# Altium project esp32v4.PrjPcb
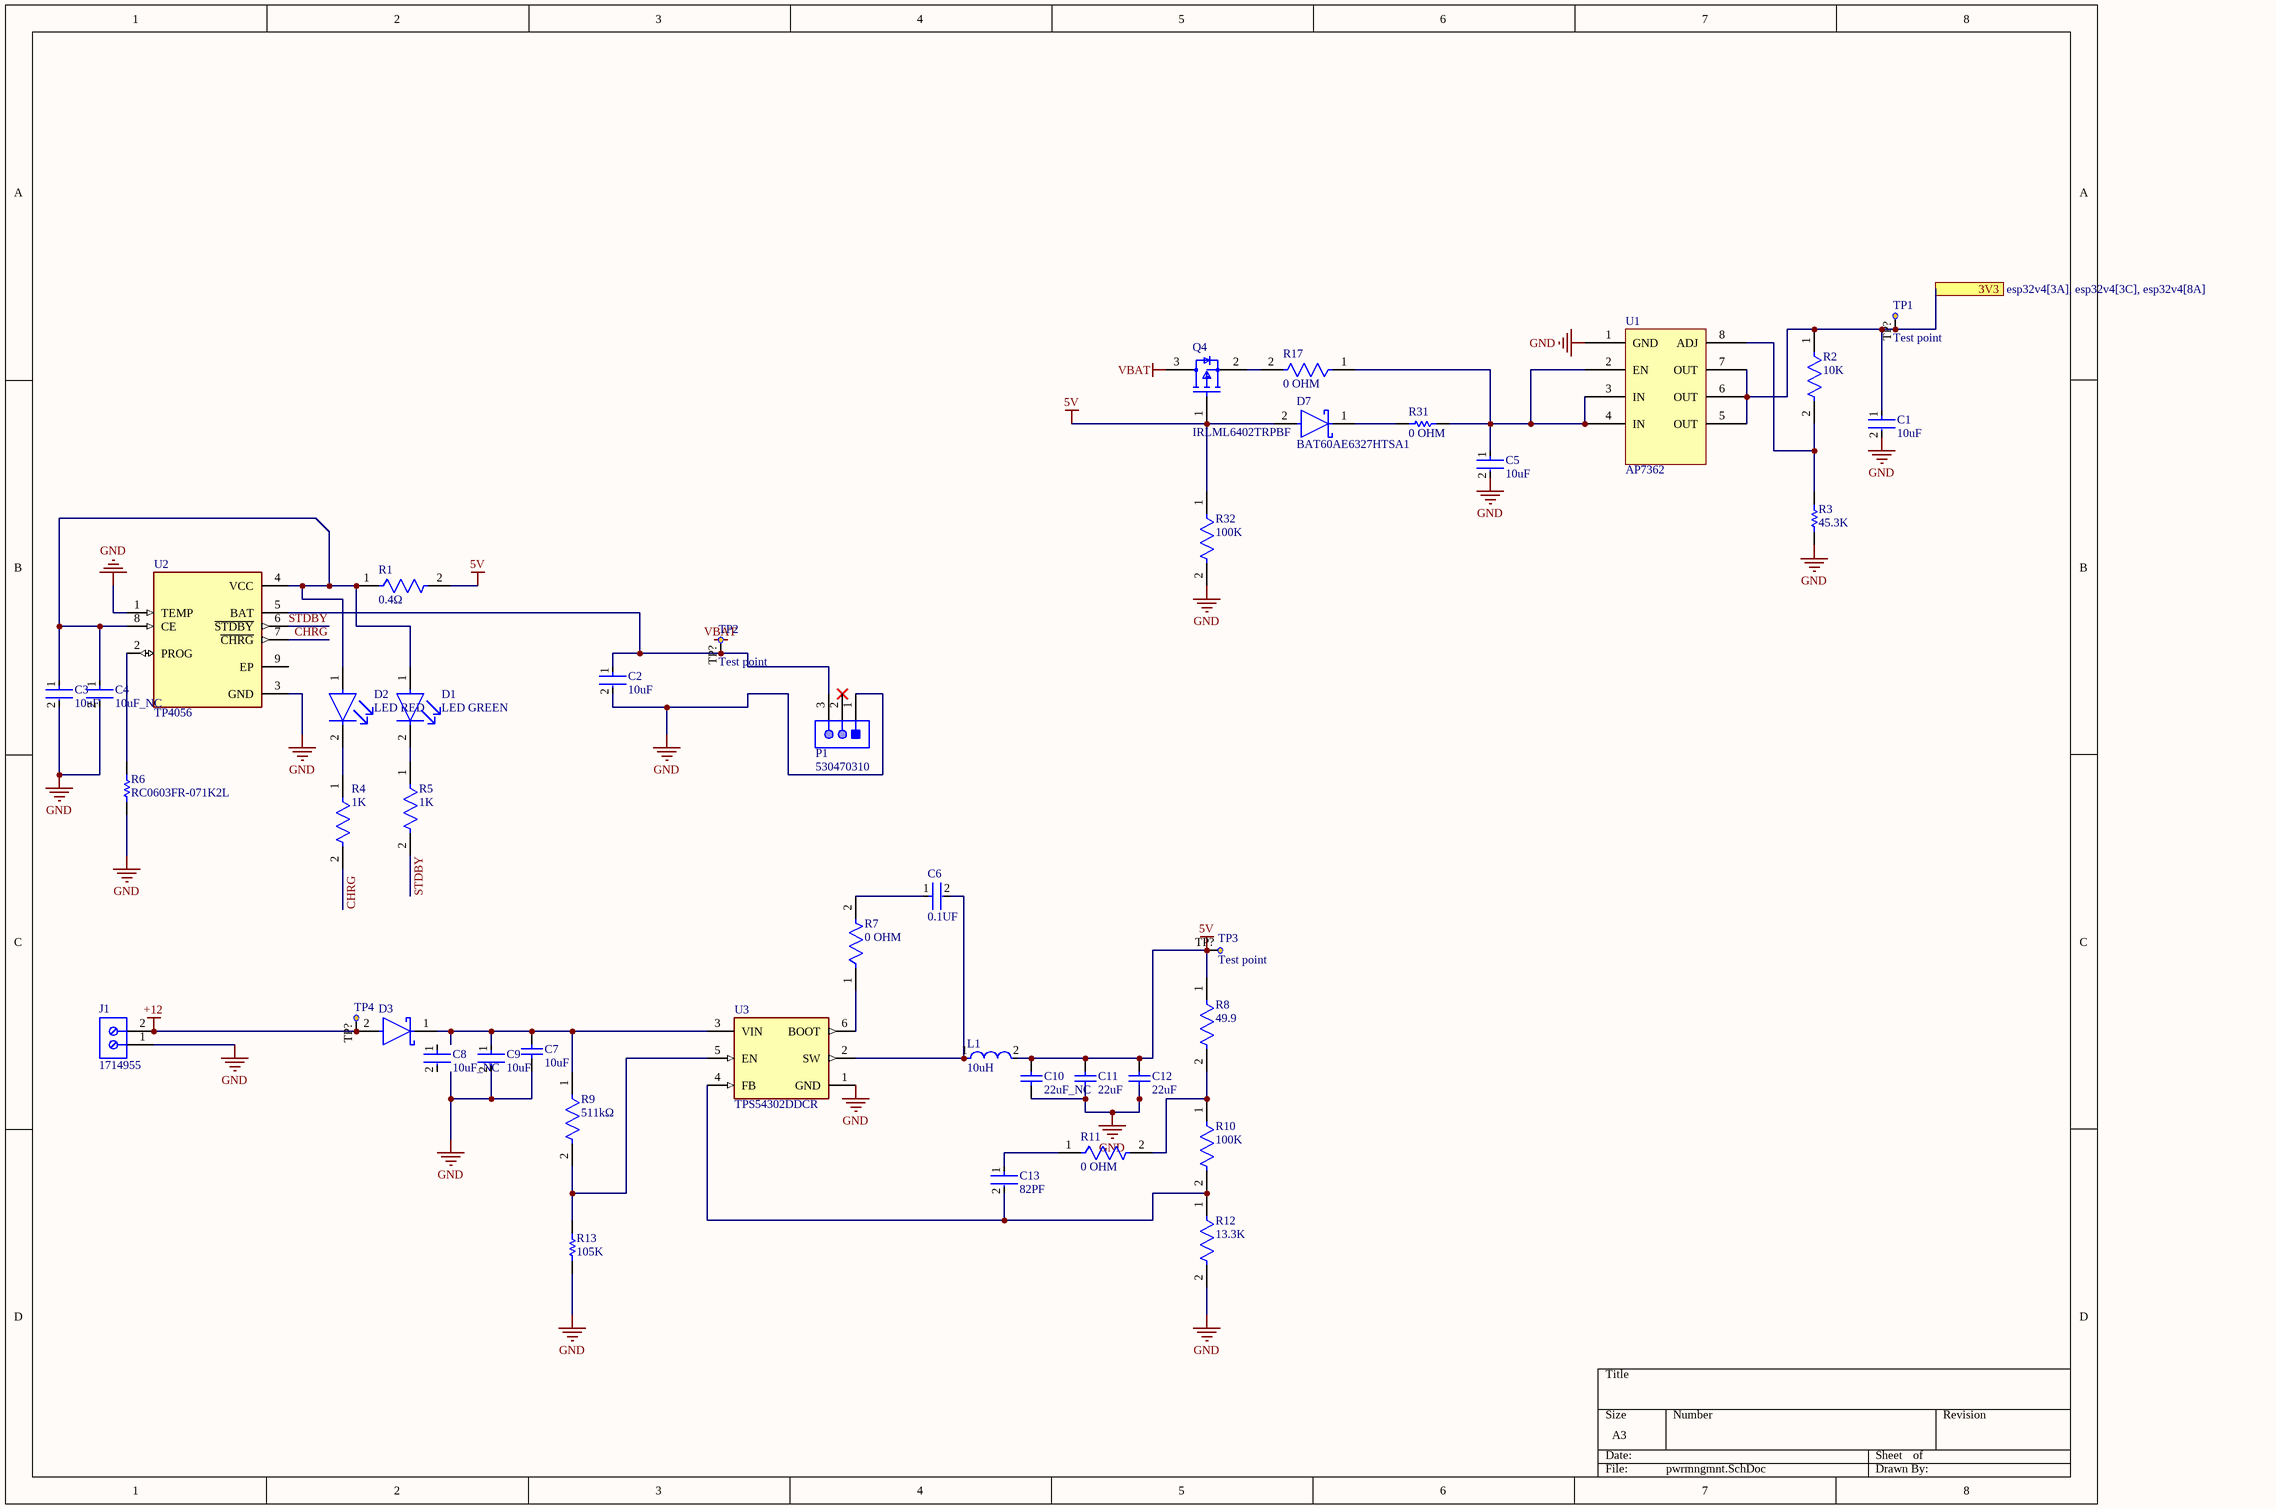
[diagram p0: pwrmngmnt.SchDoc]
2 sheets, 107 parts. Net scope: flat (ports and power ports of the same name join across sheets).
Board file: esp32v4.PcbDoc
Sheets:
  pwrmngmnt.SchDoc
  esp32v4.SchDoc

## Sheet pwrmngmnt.SchDoc
size A3; SheetNumber: 1; SheetTotal: 2

### Parts
C1  10uF  [FP-GRM21B-0_1-IPC_C]
C2  10uF  [FP-1210-L_3_3_0_4-W_2_5_0-IPC_B]
C3  10uF  [FP-GRM21B-0_1-IPC_C]
C4  10uF_NC  [FP-GRM21B-0_1-IPC_C]
C5  10uF  [FP-GRM21B-0_1-IPC_C]
C6  0.1UF  [FP-CC0805-0_85-MFG]
C7  10uF  [CAPC1210(3225)280_L]
C8  10uF_NC  [FP-GRM21B-0_1-IPC_C]
C9  10uF  [FP-GRM21B-0_1-IPC_C]
C10  22uF_NC  [CAPC1210(3225)230_L]
C11  22uF  [CAPC1210(3225)230_L]
C12  22uF  [CAPC1210(3225)230_L]
C13  82PF  [FP-C0603C-CF-MFG]
D1  LED GREEN  [FP-APT2012MGC-MFG]
D2  LED RED  [FP-AP2012EC-MFG]
D3  SS34-E3/57T  [FP-95402-MFG]  (value not drawn)
D7  BAT60AE6327HTSA1  [FP-PG-SOD323-2-IPC_C]
J1  1714955  [PHOE-1714955_V]
L1  10uH  [FP-CB3225-IPC_A]
P1  530470310  [MOLX-530470310_V]
Q4  IRLML6402TRPBF  [FP-Micro3-MFG]
R1  0.4Ω  [FP-CSR1206-IPC_C]
R2  10K  [FP-RT0603-MFG]
R3  45.3K  [RESC2013X60X35NL10T20]
R4  1K  [FP-RT0603-MFG]
R5  1K  [FP-RT0603-MFG]
R6  RC0603FR-071K2L  [RESC1608X55X25LL10T15]
R7  0 OHM  [FP-RMCF0805-MFG]
R8  49.9  [FP-CPF0603-MFG]
R9  511kΩ  [FP-CRCW0805-e3-IPC_B]
R10  100K  [FP-RT0402-MFG]
R11  0 OHM  [FP-RMCF0805-MFG]
R12  13.3K  [FP-ERJ3EK-MFG]
R13  105K  [RESC2013X60X35LL10T20]
R17  0 OHM  [FP-RMCF0805-MFG]
R31  0 OHM  [RESC1608X55X25ML10T15]
R32  100K  [FP-RT0402-MFG]
TP1  Test point  [Test_Point]
TP2  Test point  [Test_Point]
TP3  Test point  [Test_Point]
TP4  Test point  [Test_Point]  (value not drawn)
U1  AP7362  [SOIC127P600X163-9N]
U2  TP4056  [SOP127P600X175-9N]
U3  TPS54302DDCR  [FP-DDC0006A-MFG]

### Ports
3V3 (see esp32v4[3A], esp32v4[3C], esp32v4[8A])

### Nets
5V: C10.1 C11.1 C12.1 D7.2(A) L1.2 Q4.1(G) R1.2 R8.1 R32.1 TP3.TP?(Test_point)
+12: D3.2(A) J1.2 TP4.TP?(Test_point)
GND: C1.2 C2.2 C3.2 C4.2 C5.2 C7.2 C9.2 C10.2 C11.2 C12.2 J1.1 P1.1 R3.2 R6.2 R12.2 R13.1 R32.2 U1.1(GND) U2.1(TEMP) U2.3(GND) U3.1(GND)
VBAT: C2.1 P1.3 Q4.3(D) TP2.TP?(Test_point) U2.5(BAT)
3V3: C1.1 R2.1 TP1.TP?(Test_point) U1.5(OUT) U1.6(OUT) U1.7(OUT) ; port 3V3
CHRG: R4.2 U2.7(~{CHRG})
STDBY: R5.2 U2.6(~{STDBY})
NetC3_1: C3.1 C4.1 D1.1(A) D2.1(A) R1.1 U2.4(VCC) U2.8(CE)
NetC5_1: C5.1 R17.1 R31.2 U1.2(EN) U1.3(IN) U1.4(IN)
NetC6_1: C6.1 R7.2
NetC6_2: C6.2 L1.1 U3.2(SW)
NetC7_1: C7.1 C9.1 D3.1(C) R9.1 U3.3(VIN)
NetC13_1: C13.1 R11.1
NetC13_2: C13.2 R10.2 R12.1 U3.4(FB)
NetD1_2: D1.2(C) R5.1
NetD2_2: D2.2(C) R4.1
NetD7_1: D7.1(C) R31.1
NetQ4_2: Q4.2(S) R17.2
NetR2_2: R2.2 R3.1 U1.8(ADJ)
NetR6_1: R6.1 U2.2(PROG)
NetR7_1: R7.1 U3.6(BOOT)
NetR8_2: R8.2 R10.1 R11.2
NetR9_2: R9.2 R13.2 U3.5(EN)

Not connected (* = marked no-connect by the designer): C8 1 2; P1 2*; U2 9(EP)

### Library data of the parts
C1 C3-C5 C8 C9 = CMP-2007-03453-2: Chip Multilayer Ceramic Capacitors for General Purpose, 0805, 10uF, X5R, 15%, 10%, 16V; Radiation Hardening: No; Thickness: 0.053inch; Voltage Rating (DC): 16V; Lead Free: Lead Free; Package Quantity: 1; Width: 1.25mm; Case Code (Imperial): 0805; Depth: 1.25mm; Packaging: Tape and Reel; Dielectric: X5R; Max Operating Temperature: 85°C; Tolerance: 10%; Voltage Rating: 16V; Voltage: 16V; Capacitance: 10uF; Height: 1.25mm; Case Code (Metric): 2012; Material: Ceramic; Mount: Surface Mount; Case/Package: 0805; REACH SVHC: No SVHC; Length: 2mm; Min Operating Temperature: -55°C; Termination: SMD/SMT; Value: 10uF
C2 = CMP-2000-05480-2: General Purpose Ceramic Capacitor, 1210, 10uF, 10%, X7R, 15%, 50V; Thickness: 0.11inch; Capacitance: 10uF; Case Code (Imperial): 1210; Case/Package: 1210; Max Operating Temperature: 125°C; Series: -; Tolerance: 10%; Packaging: Tape and Reel; Voltage Rating: 50V; Termination: SMD/SMT; RoHS Compliant: Yes; Min Operating Temperature: -55°C; Length: 3.2mm; Lead Free: Lead Free; Voltage: 50V; REACH SVHC: No SVHC; Package Quantity: 1000; Dielectric: X7R; Depth: 2.5mm; Case Code (Metric): 3225; Voltage Rating (DC): 50V; Width: 0.098inch; Contact Plating: Tin; Mount: Surface Mount; Value: 10uF
C6 = CMP-2100-03606-3: CAP CER 0.1UF 50V X7R 0805; Manufacturer Part Number: CC0805KRX7R9BB104; Manufacturer: Yageo; Tolerance: 0.1; Capacitance: 100 nF; Value: 100 nF; Material: Ceramic; Device Class L1: Passive Components; ComponentLink2Description: Datasheet; Package: CC0805-0.85; Digikey Description: CAP CER 0.1UF 50V X7R 0805; Device Class L3: Ceramic Capacitors; Temperature: -30°C to +85°C; Temperature Characteristic: X7R; Voltage Rating: 50 V; Height: 0.95mm; RoHS: TRUE; Ipc Land Pattern Name: CAPC200125X85; Device Class L2: Capacitors; Category: Cap; Temperature Range Low: -30°C; Temperature Range High: +85°C; Mouser Description: Multilayer Ceramic Capacitors MLCC - SMD/SMT 100nF 50V X7R 10%; Footprint Url: http://www.yageo.com/exep/pages/download/literatures/UPY-C_GEN_24.pdf; Automotive: No; Octopart: https://octopart.com/cc0805krx7r9bb104-yageo-192993; Lead Free: Yes; ComponentLink2URL: http://www.yageo.com/documents/recent/UPY-GPHC_Y5V_6.3V-to-50V_8.pdf
C7 = CMP-1038-02227-2: CAP 10uF 25V ±10% 1210 (3225 Metric) Thickness 2.8mm SMD; Case-EIA: 1210; Tolerance: Â±10%; Case-Metric: 3225; Value: 10uF; Max Thickness: 2.8 mm; Technology: SMT; Rated Voltage: 25 V
C10-C12 = CMP-1038-02281-3: CAP 22uF 16V -20% to +80% 1210 (3225 Metric) Thickness 2.2mm SMD; Case-EIA: 1210; Case-Metric: 3225; Rated Voltage: 16 V; Technology: SMT; Tolerance: -20% to +80%; Max Thickness: 2.2 mm; Value: 22uF
C13 = CMP-2006-03274-2: CAP CER 82PF 50V C0G/NP0 0603; Manufacturer Part Number: C0603C820J5GACTU; Manufacturer: KEMET; Temperature Coefficient: 30ppm/°C; Tolerance: 0.05; Material: Ceramic; Temperature Characteristic: C0G; Automotive Grade: Grade 1; Temperature Range High: +125°C; Voltage Rating: 50 V; Device Class L3: Ceramic Capacitors; Category: Cap; Temperature Range Low: -55°C; Temperature: -55°C to +125°C; Package: C0603C-CF; Height: 0.87mm; Digikey Description: CAP CER 82PF 50V C0G/NP0 0603; Automotive: Yes; Capacitance: 82 pF; ComponentLink2URL: https://api.kemet.com/component-edge/download/datasheet/C0603C100J5GACAUTO.pdf; Value: 82 pF; Octopart: https://octopart.com/c0603c820j5gactu-kemet-96229; RoHS: TRUE; Device Class L2: Capacitors; Mouser Description: Multilayer Ceramic Capacitors MLCC - SMD/SMT 50volts 82pF C0G 5%; Lead Free: Yes; ComponentLink2Description: Datasheet; Device Class L1: Passive Components
D1 = CMP-44529-000017-1: LED GREEN CLEAR CHIP SMD; Power Rating: 75mW; Lens Color: Colorless; Luminous Intensity: 70mcd; Forward Current: 20mA; Dominant Wavelength: 570nm; Viewing Angle: 120°; Forward Voltage: 2.1V; Package Quantity: 2000; Color: Green; Length: 2mm; Lead Free: Lead Free; Min Operating Temperature: -40°C; Illumination Color: Green; Case/Package: 0805; Width: 1.25mm; Test Current: 20mA; Max Operating Temperature: 85°C; Case Code (Imperial): 0805; Mount: Surface Mount; Lens Style: Clear; Height: 0.75mm; Case Code (Metric): 2012; Packaging: Tape and Reel; Lens Transparency: Clear
D2 = CMP-44529-000070-1: LED RED CLEAR SMD; Forward Voltage: 2V; Test Current: 20mA; Luminous Intensity: 15mcd; Viewing Angle: 120°; Wavelength: 627nm; Dominant Wavelength: 625nm; Lead Free: Lead Free; Length: 2mm; Forward Current: 20mA; Mount: Surface Mount; Packaging: Tape and Reel; Illumination Color: Red; Color: Red; Height: 1.1mm; Case Code (Metric): 2012; Case Code (Imperial): 0805; Case/Package: 0805; Width: 1.25mm; RoHS Compliant: Yes; Package Quantity: 2000; Min Operating Temperature: -40°C; Max Operating Temperature: 85°C; Lens Style: Clear
D3 = CMP-02539-000012-1: DIODE SCHOTTKY 40V 3A DO214AB; Manufacturer: Vishay; Max Junction Temp: +150°C; Peak Reverse Current: 0.5mA; Max Surge Forward Current: 100A; Standoff Height: 0mm; ComponentLink2Description: Datasheet; Device Class L3: Schottky Diodes; Height: 2.62mm; Max Repetitive Reverse Voltage: 40V; Lead Free: Yes; Package: 95402; Temperature Range High: +150°C; ComponentLink2URL: http://www.vishay.com/docs/88751/ss32.pdf; Temperature: -55°C to +150°C; Footprint Url: http://www.vishay.com/docs/95402/smc.pdf; Automotive: No; Forward Current: 3A; Category: Diode; Manufacturer Part Number: SS34-E3/57T; RoHS: TRUE; Device Class L2: Diodes; Mouser Description: Schottky Diodes & Rectifiers 3.0 Amp 40 Volt; Octopart: https://octopart.com/ss34-e3%2F57t-vishay-39552907; Temperature Range Low: -55°C; Device Class L1: Discrete Semiconductors; Digikey Description: DIODE SCHOTTKY 40V 3A DO214AB
D7 = CMP-32890-000004-1: DIODE SCHOTTKY 10V 3A SOD323-2; Forward Voltage: 370mV; Polarity: Standard; Peak Non-Repetitive Surge Current: 5A; Element Configuration: Single; Max Operating Temperature: 85°C; Current Rating: 3A; Number of Pins: 2; Mount: Surface Mount; Forward Current: 3A; Max Reverse Voltage (DC): 10V; Output Current: 3A; Contact Plating: Tin; Average Rectified Current: 3A; Lead Free: Lead Free; Max Repetitive Reverse Voltage (Vrrm): 10V; Voltage Rating (DC): 10V; Radiation Hardening: No; Halogen Free: Not Halogen Free; Case/Package: SOD-323-2; REACH SVHC: No SVHC; Min Operating Temperature: -55°C; Packaging: Tape and Reel
J1 = CMP-2000-05797-1: PC Terminal Block, Pitch 6.35 mm, 1 x 2 Position, Height 21.5 mm, Tail Lenght 5.1 mm, RoHS, Bulk; Manufacturer: Phoenix Contact; Package Description: PC Terminal Block, Pitch 6.35 mm, 1 x 2 Position, Height 21.5 mm, Tail Lenght 5.1 mm; Datasheet URL: http://media.digikey.com/pdf/Data%20Sheets/Phoenix%20Contact%20PDFs/1714955.pdf; Package Reference: 1714955; Manufacturer URL: http://www.phoenixcontact.com/; Datasheet Version: 02/2010; Mounting Technology: ThroughHole
L1 = CMP-14484-000123-1: SMD Inductors 10uH ±20% 0.9A 0.1729Ω 1210; Shielding: Unshielded; DC Resistance (DCR): 172.9mR; Core Material: Ferrite; Self Resonant Frequency: 23MHz; Max DC Current: 900mA; Test Frequency: 100kHz; Package Quantity: 1000; Military Standard: Not; Inductance: 10uH; Height: 2.5mm; Case Code (Metric): 3225; Width: 0.098inch; Case Code (Imperial): 1210; Inductance Tolerance: 20%; Lead Free: Lead Free; Length: 3.4mm; Max Operating Temperature: 105°C; Resistor Type: Wirewound; Height - Seated (Max): 0.106inch; Series: CB; Packaging: Tape and Reel; Depth: 2.7mm; Number of Pins: 2; Radiation Hardening: No; Tolerance: 20%; Case/Package: 1210; Mount: Surface Mount; Saturation Current: 900mA; Min Operating Temperature: -40°C; DC Current: 900mA; Current Rating: 900mA; Halogen Free: Halogen Free; Termination: SMD/SMT; Value: 10uH
P1 = CMP-2000-05465-1: Male Header, Pitch 1.25 mm, 1 x 3 Position, Height 4.2 mm, Tail Length 2.3 mm, -40 to 85 degC, RoHS, Tray; Manufacturer: Molex; Datasheet Version: Rev. E, 11/1994; Mounting Technology: ThroughHole; Package Reference: 530470310; Datasheet URL: http://www.molex.com/pdm_docs/sd/530470310_sd.pdf; Package Description: Male Header, Pitch 1.25 mm, 1 x 3 Position, Height 4.2 mm, Tail Length 2.3 mm; Manufacturer URL: http://www.molex.com/
Q4 = CMP-32901-000130-1: MOSFET P-CH 20V 3.7A SOT-23; Manufacturer: Infineon; Reverse Recovery Time: 29ns; Max Forward Diode Voltage: -1.2V; Input Capacitace At Vds: 633pF @ -10V; Drain To Source Resistance: 0.05Ω; Gate To Source Voltage: 12V; Max Junction Temp: +150°C; Pulse Drain Current: -22A; Threshold Vgs Min: -0.4V; Turn Off Delay Time: 588ns; Number Of Channels: 1; Power Dissipation: 1.3W; Turn On Delay Time: 350ns; Drain To Source Breakdown Voltage: -20V; Continuous Drain Current: -3.7A; Depletion Mode: False; Gate Charge At Vgs: 8nC @ -5V; Rthja Max: 75°C/W; Threshold Vgs: -0.55V; Standoff Height: 0.01mm; Reverse Recovery Charge: 11nC; Device Class L2: Transistors; Ipc Land Pattern Name: SOT95P237X100-3; Temperature Range High: +150°C; Octopart: https://octopart.com/irlml6402trpbf-infineon-65874989; ComponentLink2URL: https://www.infineon.com/dgdl/irlml6402pbf.pdf?fileId=5546d462533600a401535668d5c2263c; Automotive: No; Manufacturer Part Number: IRLML6402TRPBF; Height: 1.12mm; Drain To Source Voltage: -20V; Digikey Description: MOSFET P-CH 20V 3.7A SOT-23; Device Class L1: Discrete Semiconductors; Package: Micro3; Lead Free: Yes; Temperature Range Low: -55°C; Number Of P Channels: 1; Technology: MOSFET; Temperature: -55°C to +150°C; Category: Trans; Footprint Url: http://irf.com/package/outline/po_micro3.pdf; RoHS: TRUE; Device Class L3: MOSFETs; Threshold Vgs Max: -1.2V; ComponentLink2Description: Datasheet
R1 = CMP-26527-004884-1: General Purpose Thick Film Chip Resistor, 1206, 0.4Ω, 5%, 100ppm/°C, 0.5W; Min Operating Temperature: -55°C; RoHS Compliant: Yes; Tolerance: 5%; Max Operating Temperature: 155°C; Mount: Surface Mount; Packaging: Tape and Reel
R2 = CMP-03412-005349-1: RES SMD 10K OHM 1% 1/10W 0603; Manufacturer: Yageo; Manufacturer Part Number: RT0603FRE0710KL; Value: 10KΩ; Temperature Coefficient: 50 ppm/°C; Power Rating: 0.1W; Tolerance: 0.01; Voltage Rating: 75V; RoHS: TRUE; Category: Res; Automotive: No; Digikey Description: RES SMD 10K OHM 1% 1/10W 0603; ComponentLink2Description: Datasheet; Octopart: https://octopart.com/rt0603fre0710kl-yageo-40009243; ComponentLink2URL: http://www.yageo.com/documents/recent/PYu-RT_1-to-0.01_RoHS_L_9.pdf; Device Class L3: Chip SMD Resistors; Device Class L1: Passive Components; Temperature Range High: +155°C; Height: 0.55mm; Composition: Thin Film; Ipc Land Pattern Name: RESC16080X45; Series: RT; Package: RT0603; Resistance: 10KΩ; Footprint Url: http://www.yageo.com/exep/pages/download/literatures/PYu-R_Mount_10.pdf; Temperature: -55°C to +155°C; Temperature Range Low: -55°C; Lead Free: Yes; Device Class L2: Resistors; Mouser Description: Thin Film Resistors - SMD 10K ohm 1% 1/10W
R3 = CMP-1013-00697-2: Part Number: RC0805FR-0745K3L; Manufacturer: Yageo
R4 R5 = CMP-03412-013082-1: RES SMD 1K OHM 0.1% 1/10W 0603; Manufacturer Part Number: RT0603BRD071KL; Manufacturer: Yageo; Voltage Rating: 75V; Temperature Coefficient: 25ppm/°C; Value: 1kΩ; Power Rating: 0.1W; Temperature Range Low: -55°C; Series: RT; Digikey Description: RES SMD 1K OHM 0.1% 1/10W 0603; Tolerance: 0.1%; Category: Res; RoHS: TRUE; Composition: Thin Film; ComponentLink2Description: Datasheet; Footprint Url: https://www.yageo.com/upload/website/yageo_PYu-R_Mount_10_19050818_343.pdf; Temperature: -55°C to +155°C; ComponentLink2URL: https://www.yageo.com/upload/media/product/productsearch/datasheet/rchip/PYu-RT_1-to-0.01_RoHS_L_11.pdf; Automotive: No; Octopart: https://octopart.com/rt0603brd071kl-yageo-1433776; Device Class L1: Passive Components; Device Class L2: Resistors; Temperature Range High: +155°C; Height: 0.55mm; Device Class L3: Chip SMD Resistors; Lead Free: Yes; Resistance: 1kΩ; Package: RT0603
R6 = CMP-1659-00042-1: Chip Resistor, 1.2 KOhm, +/- 1%, 0.1 W, -55 to 155 degC, 0603 (1608 Metric), RoHS, Tape and Reel; Resistance: 825 kohm; Voltage Rating: 50 V; Power Rating: 100 mW; Case\Package: 0603; DatasheetVersion: Rev. 4, 02/2016; Package Quantity: 5000; Min Operating Temperature: -55 degC; PackageReference: 0603; ComponentLink1Description: Manufacturer URL; Tolerance: 1%; ComponentLink2Description: Datasheet; Packaging: Tape and Reel; PackageDescription: 2-Pin Surface Mount Device, Body 1.6 x 0.8 mm; Width: 0.8 mm; ComponentLink2URL: http://www.yageo.com/documents/recent/PYu-RC_Group_51_RoHS_L_04.pdf; ComponentLink1URL: http://www.yageo.com/; Max Operating Temperature: 155 degC; RoHSCompliant: true; Height: 0.45 mm; Case Code (Imperial): 0603; Case Code (Metric): 1608; Length: 1.6 mm
R7 R11 R17 = CMP-26527-000017-1: RES 0 OHM JUMPER 1/8W 0805; Power Rating: 125mW; Resistance: 0mR; Depth: 1.25mm; Length: 2mm; Military Standard: Not; Width: 0.049inch; Case Code (Imperial): 0805; Number of Terminations: 2; Mount: Surface Mount; Contact Plating: Tin; Height: 0.026inch; Case/Package: 0805; Min Operating Temperature: -55°C; Composition: Thick Film; Max Operating Temperature: 155°C; Packaging: Tape and Reel; Features: Automotive AEC-Q200; Max Power Dissipation: 125mW; Radiation Hardening: No; Lead Free: Lead Free; Case Code (Metric): 2012
R8 = CMP-03211-000514-1: RES SMD 49.9Ω 1% 1/16W 0603; Manufacturer Part Number: CPF0603F49R9C1; Manufacturer: TE Connectivity; Power Rating: 0.063W; Temperature Coefficient: 50ppm/°C; Voltage Rating: 50V; Tolerance: 1%; Category: Res; Octopart: https://octopart.com/cpf0603f49r9c1-te+connectivity-42012738; Lead Free: Yes; Package: CPF0603; packaging: 1k Reel; Resistance: 49.9Ω; Device Class L1: Passive Components; octopart_url: https://octopart.com/cpf0603f49r9c1-te+connectivity-42012738; Temperature Range High: +155°C; RoHS: TRUE; ComponentLink2URL: https://www.te.com/commerce/DocumentDelivery/DDEController?Action=showdoc&DocId=Data+Sheet%7F1773200%7FM%7Fpdf%7FEnglish%7FENG_DS_1773200_M.pdf%7F3-1676481-2; Device Class L3: Chip SMD Resistors; Composition: Thin Film; Value: 49.9Ω; Height: 0.55mm; Automotive: No; Device Class L2: Resistors; Series: CPF; ComponentLink2Description: Datasheet; Temperature: -55°C to +155°C; Temperature Range Low: -55°C; Ipc Land Pattern Name: RESC15580X45
R9 = CMP-2001-03991-2: RES Thick Film, 511kΩ, 1%, 0.125W, 100ppm/°C, 0805; Power Rating: 125mW; Voltage Rating: 150V; Resistance: 511kR; Value: 511kR; Case Code (Metric): 2012; Tolerance: 1%; Technology: THICK FILM; RoHS Compliant: Yes; Size Code: 0805; Length: 2mm; Series: CRCW; Number of Terminations: 2; Radiation Hardening: No; Height: 0.45mm; Construction: Rectangular; Case/Package: 0805; Number of Pins: 2; Depth: 1.25mm; Width: 1.25mm; Case Code (Imperial): 0805; Package Quantity: 10; Contact Plating: Tin; Termination: SMD/SMT; Temperature Coefficient: 100ppm/°C; Military Standard: Not; Min Operating Temperature: -55°C; Resistor Type: Thick Film; Features: Automotive AEC-Q200; Packaging: Tape and Reel; Max Power Dissipation: 125mW; Max Operating Temperature: 155°C; Weight: 0.000194oz; Resistance Tolerance: 1%
R10 R32 = CMP-2002-02911-2: RES 100K OHM 1/16W .1% SMD 0402; Manufacturer Part Number: RT0402BRD07100KL; Manufacturer: Yageo; Temperature Coefficient: 25 ppm/°C; Resistance: 100KΩ; Voltage Rating: 50V; Tolerance: 0.001; Value: 100KΩ; Power Rating: 0.063W; ComponentLink2Description: Datasheet; Temperature: -55°C to +155°C; Automotive: No; Ipc Land Pattern Name: RESC10050X30; Temperature Range Low: -55°C; Package: RT0402; Digikey Description: RES 100K OHM 1/16W .1% SMD 0402; Height: 0.35mm; Footprint Url: http://www.yageo.com/exep/pages/download/literatures/PYu-R_Mount_10.pdf; Temperature Range High: +155°C; Category: Res; Composition: Thin Film; Lead Free: Yes; Octopart: https://octopart.com/rt0402brd07100kl-yageo-1211784; Device Class L1: Passive Components; Device Class L2: Resistors; RoHS: TRUE; ComponentLink2URL: http://www.yageo.com/documents/recent/PYu-RT_1-to-0.01_RoHS_L_9.pdf; Device Class L3: Chip SMD Resistors; Series: RT; Mouser Description: Thin Film Resistors - SMD 1/16W 100K ohm .1% 25ppm
R12 = CMP-2000-00238-2: NexarPartId: 55421458; Max Power Dissipation: 100mW; Temperature Coefficient: 100ppm/°C; Voltage Rating: 75V; Voltage Rating (DC): 50V; Resistance: 13.3kΩ; Tolerance: 1%; Number of Terminations: 2; Depth: 800µm; Termination: SMD/SMT; Lifecycle Status: Production; Max Operating Temperature: 155°C; Case Code (Imperial): 0603; Width: 800µm; Length: 1.6mm; Features: Automotive AEC-Q200; Lead Free: Lead Free; RoHS: Compliant; Schedule B: 8533210045, 8533210045; Min Operating Temperature: -55°C; Case/Package: 0603; Mount: Surface Mount; Military Standard: Not; Case Code (Metric): 1608; Contact Plating: Tin; Power Rating: 100mW; REACH SVHC: No SVHC; Height: 558.8µm; Packaging: Cut Tape; Composition: Thick Film
R13 = CMP-2001-04571-1: Part Number: RC0805FR-07105KL; Manufacturer: Yageo
R31 = CMP-2100-03667-1: Chip Resistor, 0 Ohm, +/- 5%, 0.1 W, -55 to 155 degC, 0603 (1608 Metric), RoHS, Tape and Reel; Manufacturer: Yageo; Temperature Coefficient: 200ppm/degreesC; Voltage Rating: 50V; Power Rating: 100mW; Resistance: 0mOhm; Width: 0.8mm; Max Operating Temperature: 155degC; Tolerance: 5%; Package Reference: 0603; Height: 0.45mm; Depth: 0.8mm; Package Description: 2-Pin Surface Mount Device, Body 1.6 x 0.8 mm; Termination: SMD/SMT; Package Quantity: 5000; Case/Package: 0603; Case Code (Imperial): 0603; Radiation Hardening: No; Number of Pins: 2; Length: 1.6mm; Lead Free: LeadFree; Voltage Rating (DC): 50V; Military Standard: Not; Datasheet URL: http://www.yageo.com/NewPortal/yageodocoutput?fileName=/pdf/R-Chip/PYu-RC_Group_51_RoHS_L_5.pdf; Manufacturer URL: http://www.yageo.com/; Packaging: TapeandReel; Case Code (Metric): 1608; Min Operating Temperature: -55degC; Composition: ThickFilm; RoHSCompliant: true; Contact Plating: Tin; Datasheet Version: Rev. 5, 10/2016; REACH SVHC: NoSVHC
TP1-TP4 = Test_Point: Value: Test point
U1 = Component_1
U2 = TP4056: Complete single cell Li-Ion battery with a constant current / constant voltage linear charger; MF: NanJing Top Power ASIC Corp.; Check_prices: https://www.snapeda.com/parts/TP4056/NanJing+Top+Power+ASIC+Corp./view-part/?ref=eda; SnapEDA_Link: https://www.snapeda.com/parts/TP4056/NanJing+Top+Power+ASIC+Corp./view-part/?ref=snap; Price: None; Availability: Not in stock; Package: Package; MP: TP4056; Value: *
U3 = CMP-04918-000032-1: IC REG BUCK ADJ 3A TSOT23-6; Manufacturer: Texas Instruments; Output Voltage: 0.6-26V; Output Type: AdjustableProgrammable; Max Junction Temp: +125°C; Number Of Outputs: 1; Min Supply Voltage: 4.5V; Switching Frequency: 400kHz; Standoff Height: 0mm; Max Duty Cycle: 100%; Nominal Supply Current: 45uA; Max Supply Voltage: 28V; Temperature Range High: +125°C; Switching Topology: Buck; Device Class L2: Power Management ICs; Output Current: 3A; Automotive: No; Temperature Range Low: -40°C; Temperature: -40°C to +125°C; Height: 1.1mm; Ipc Land Pattern Name: SOT95P280X110-6; RoHS: TRUE; Digikey Description: IC REG BUCK ADJ 3A TSOT23-6; Manufacturer Part Number: TPS54302DDCR; ComponentLink2Description: Datasheet; Device Class L3: Voltage Regulators - Switching; Octopart: https://octopart.com/tps54302ddcr-texas+instruments-74209025; Device Class L1: Integrated Circuits (ICs); Lead Free: Yes; ComponentLink2URL: http://www.ti.com/lit/ds/symlink/tps54302.pdf; Category: IC; Package: DDC0006A

## Sheet esp32v4.SchDoc
size A2; SheetNumber: 2; SheetTotal: 2
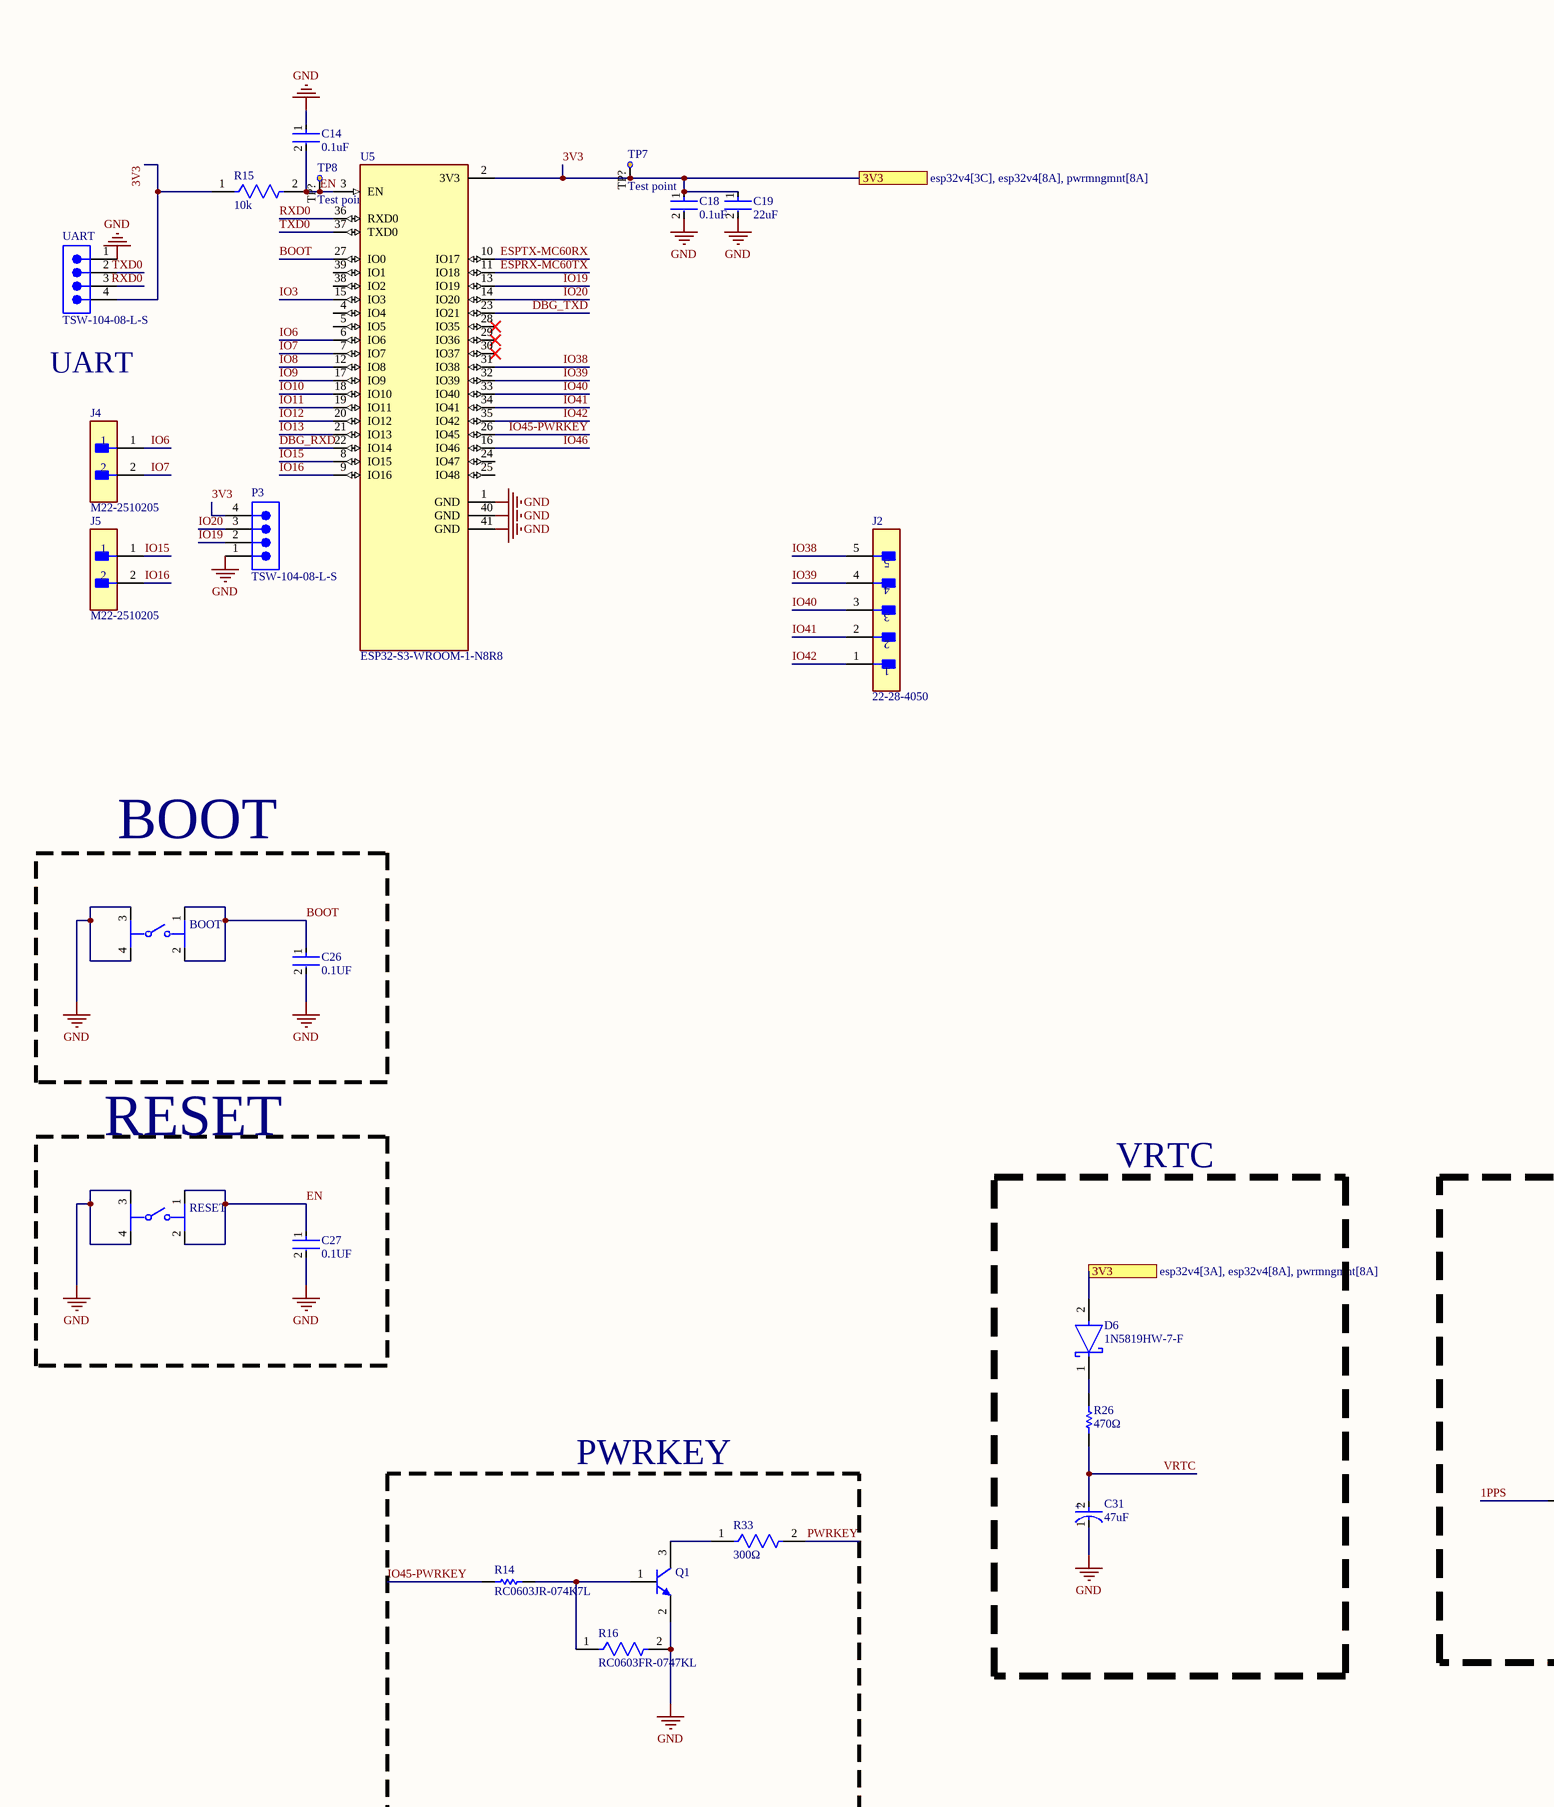
[diagram p1: esp32v4.SchDoc, left]
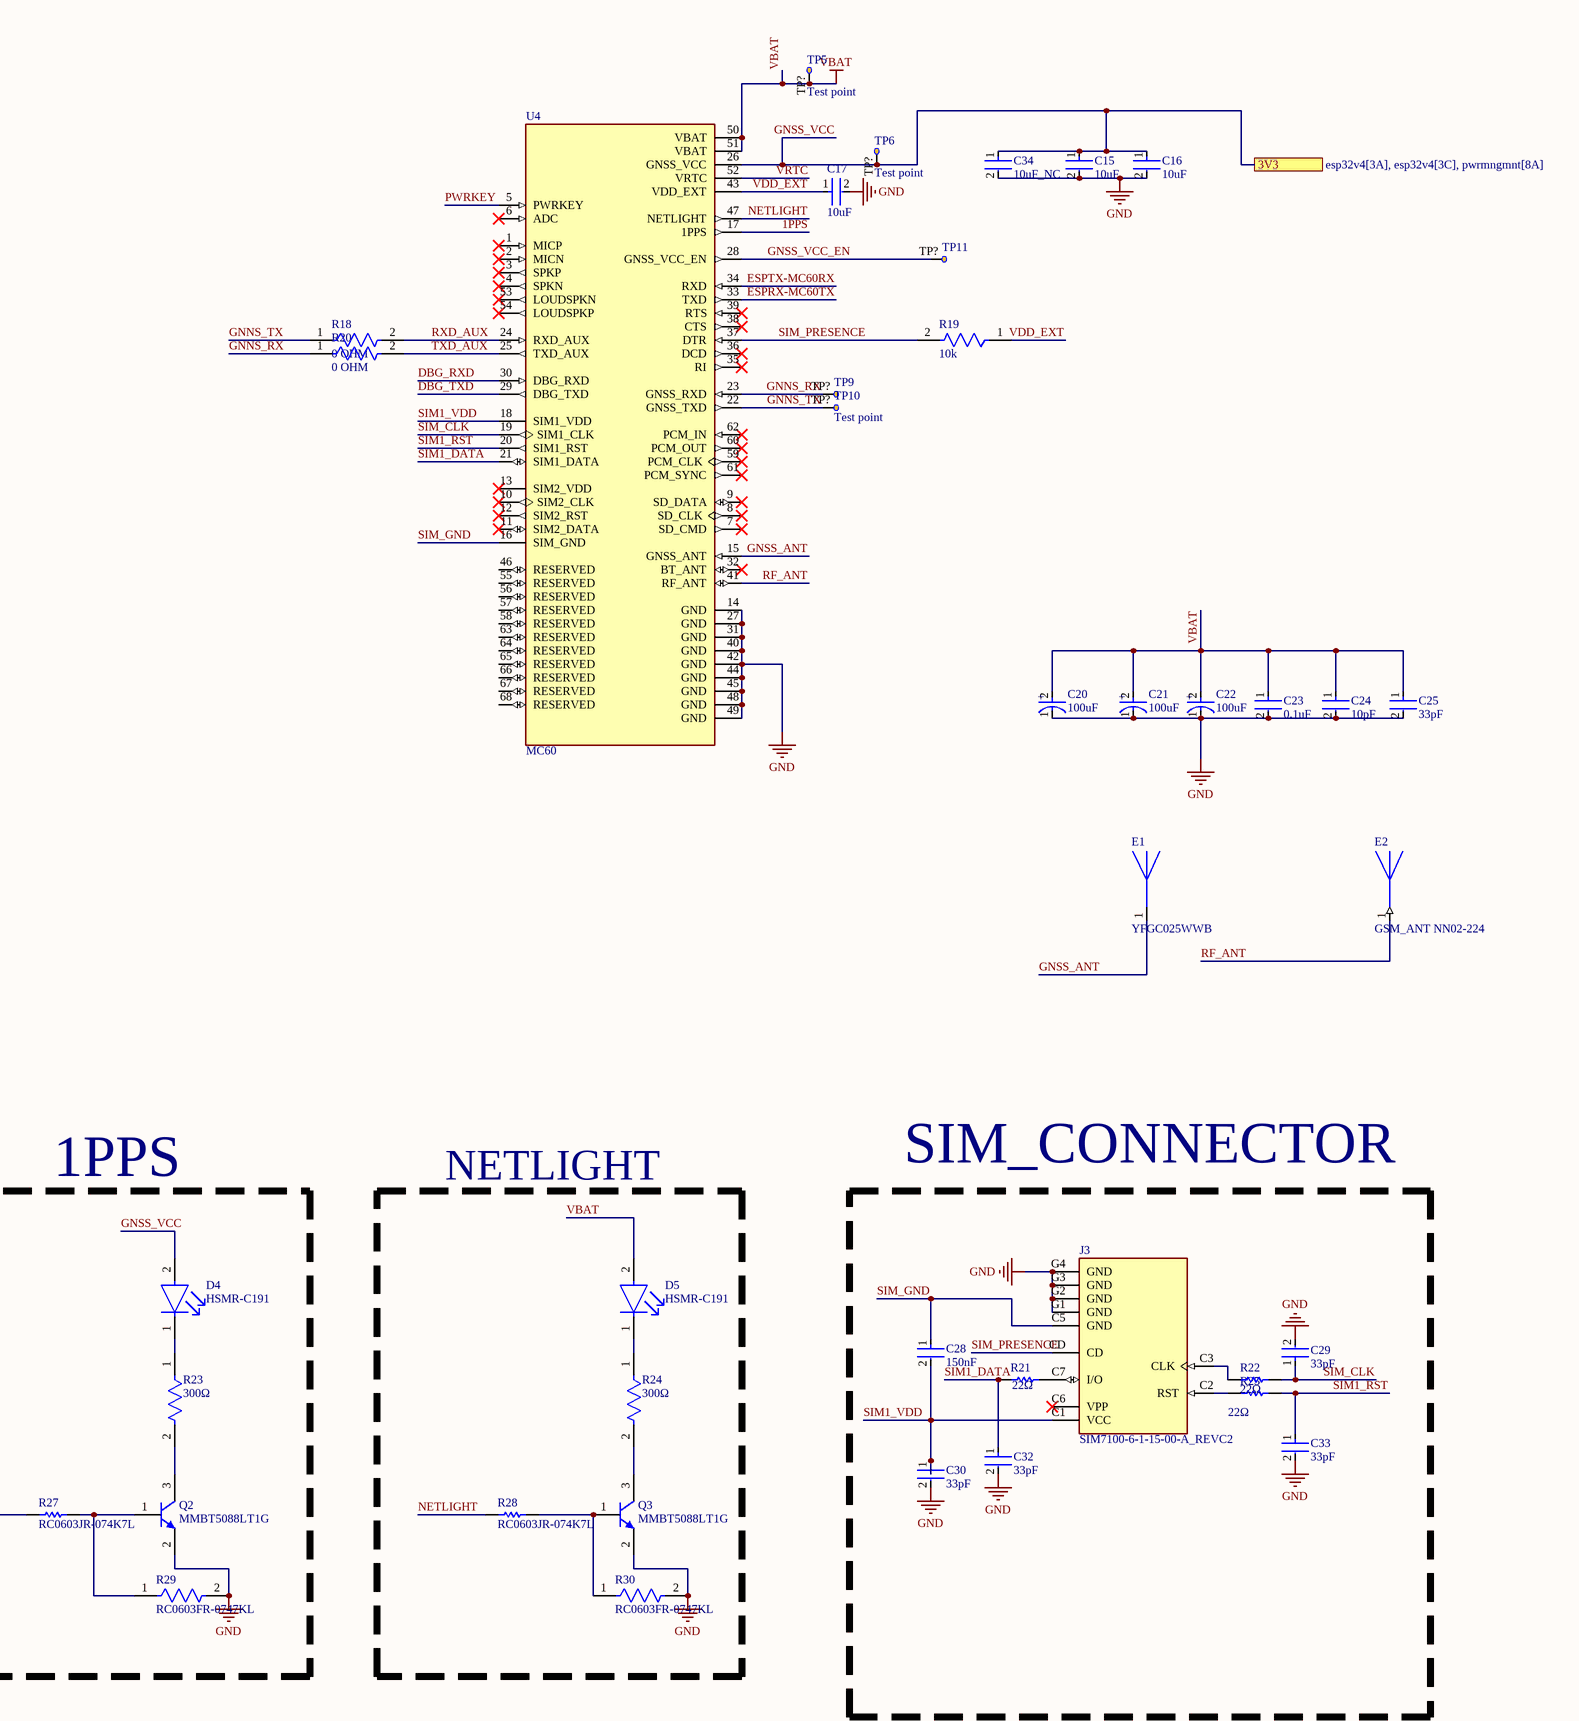
[diagram p2: esp32v4.SchDoc, right]

### Parts
BOOT  PTS810SJM250SMTRLFS  [FP-PTS810SJM250SMTRLFS-MFG]  (value not drawn)
C14  0.1uF  [FP-CC0805-0_85-MFG]
C15  10uF  [FP-C0805C106K4PACTU-MFG]
C16  10uF  [FP-CC0805-0_85-MFG]
C17  10uF  [FP-C0805C106K4PACTU-MFG]
C18  0.1uF  [FP-CC0805-0_85-MFG]
C19  22uF  [FP-GRM21B-0_15-MFG]
C20  100uF  [FP-SC-MFG]
C21  100uF  [FP-SC-MFG]
C22  100uF  [FP-SC-MFG]
C23  0.1uF  [FP-CC0805-0_85-MFG]
C24  10pF  [FP-C0805C-DN-MFG]
C25  33pF  [FP-C0603C-CF-MFG]
C26  0.1UF  [FP-CC0805-0_85-MFG]
C27  0.1UF  [FP-CC0805-0_85-MFG]
C28  150nF  [FP-CL21-IPC_C]
C29  33pF  [FP-0603-L_1_6_0_15-W_0_81-IPC_C]
C30  33pF  [FP-0603-L_1_6_0_15-W_0_81-IPC_C]
C31  47uF  [FP-OS-CON-SMT-C6-MFG]
C32  33pF  [FP-0603-L_1_6_0_15-W_0_81-IPC_C]
C33  33pF  [FP-0603-L_1_6_0_15-W_0_81-IPC_C]
C34  10uF_NC  [FP-C0805C106K4PACTU-MFG]
D4  HSMR-C191  [FP-HSMR-C191-MFG]
D5  HSMR-C191  [FP-HSMR-C191-MFG]
D6  1N5819HW-7-F  [FP-SOD123-IPC_A]
E1  YFGC025WWB  [XDCR_YFGC025WWB]
E2  GSM_ANT NN02-224  [XCVR_NN02-224]
J2  22-28-4050  [FP-22-28-4050-MFG]
J3  SIM7100-6-1-15-00-A_REVC2  [GCT_SIM7100-6-1-15-00-A_REVC2]
J4  M22-2510205  [FP-M22-2510205-MFG]
J5  M22-2510205  [FP-M22-2510205-MFG]
P3  TSW-104-08-L-S  [SMTC-TSW-104-08-X-S]
Q1  MMBT5088LT1G  [ONSC-SOT-23-3-318-08_V]  (value not drawn)
Q2  MMBT5088LT1G  [ONSC-SOT-23-3-318-08_V]
Q3  MMBT5088LT1G  [ONSC-SOT-23-3-318-08_V]
R14  RC0603JR-074K7L  [RESC1608X55X25ML10T15]
R15  10k  [FP-RT0805-MFG]
R16  RC0603FR-0747KL  [FP-RC0603FR-0747KL-MFG]
R18  0 OHM  [FP-RMCF0805-MFG]
R19  10k  [FP-RT0603-MFG]
R20  0 OHM  [FP-RMCF0805-MFG]
R21  22Ω  [RESC1005X40X25ML05T05]
R22  22Ω  [RESC1005X40X25ML05T05]
R23  300Ω  [FP-CRCW0603-e3-IPC_A]
R24  300Ω  [FP-CRCW0603-e3-IPC_A]
R25  22Ω  [RESC1005X40X25ML05T05]
R26  470Ω  [RESC3216X60X45ML10T20]
R27  RC0603JR-074K7L  [RESC1608X55X25ML10T15]
R28  RC0603JR-074K7L  [RESC1608X55X25ML10T15]
R29  RC0603FR-0747KL  [FP-RC0603FR-0747KL-MFG]
R30  RC0603FR-0747KL  [FP-RC0603FR-0747KL-MFG]
R33  300Ω  [FP-CRCW0603-e3-IPC_A]
RESET  PTS810SJM250SMTRLFS  [FP-PTS810SJM250SMTRLFS-MFG]  (value not drawn)
TP5  Test point  [Test_Point]
TP6  Test point  [Test_Point]
TP7  Test point  [Test_Point]
TP8  Test point  [Test_Point]
TP9  Test point  [Test_Point]  (value not drawn)
TP10  Test point  [Test_Point]
TP11  Test point  [Test_Point]  (value not drawn)
U4  MC60  [XCVR_MC60]
U5  ESP32-S3-WROOM-1-N8R8  [XCVR_ESP32S3WROOM1N8R8]
UART  TSW-104-08-L-S  [SMTC-TSW-104-08-X-S]

### Blocks framed on the sheet
BOOT: BOOT C26
RESET: C27 RESET
VRTC: C31 D6 R26
1PPS: D4 Q2 R23 R27 R29
NETLIGHT: D5 Q3 R24 R28 R30
SIM_CONNECTOR: C28-C30 C32 C33 J3 R21 R22 R25
PWRKEY: Q1 R14 R16 R33

### Ports
3V3 (see esp32v4[3A], esp32v4[3C], pwrmngmnt[8A]), 3V3 (see esp32v4[3A], esp32v4[8A], pwrmngmnt[8A]), 3V3 (see esp32v4[3C], esp32v4[8A], pwrmngmnt[8A])

### Nets
GND: BOOT.3 BOOT.4 C14.1 C15.2 C16.2 C17.2 C18.2 C19.2 C20.1(C) C21.1(C) C22.1(C) C23.2 C24.2 C25.2 C26.2 C27.2 C29.2 C30.2 C31.1(C) C32.2 C33.2 C34.2 J3.G1(GND) J3.G2(GND) J3.G3(GND) J3.G4(GND) P3.1 Q1.2(E) Q2.2(E) Q3.2(E) R16.2 R29.2 R30.2 RESET.3 RESET.4 U4.14(GND) U4.27(GND) U4.31(GND) U4.40(GND) U4.42(GND) U4.44(GND) U4.45(GND) U4.48(GND) U4.49(GND) U5.1(GND) U5.40(GND) U5.41(GND) UART.1
VBAT: C20.2(A) C21.2(A) C22.2(A) C23.1 C24.1 C25.1 D5.2(A) TP5.TP?(Test_point) U4.50(VBAT) U4.51(VBAT)
1PPS: R27.1 U4.17(1PPS)
3V3: C15.1 C16.1 C18.1 C19.1 C34.1 D4.2(A) D6.2(A) P3.4 R15.1 TP6.TP?(Test_point) TP7.TP?(Test_point) U4.26(GNSS_VCC) U5.2(3V3) UART.4 ; port 3V3  [also labelled GNSS_VCC]
BOOT: BOOT.1 BOOT.2 C26.1 U5.27(IO0)
DBG_RXD: U4.30(DBG_RXD) U5.22(IO14)
DBG_TXD: U4.29(DBG_TXD) U5.23(IO21)
EN: C14.2 C27.1 R15.2 RESET.1 RESET.2 TP8.TP?(Test_point) U5.3(EN)
ESPRX-MC60TX: U4.33(TXD) U5.11(IO18)
ESPTX-MC60RX: U4.34(RXD) U5.10(IO17)
GNNS_RX: R20.1 TP9.TP?(Test_point) U4.23(GNSS_RXD)
GNNS_TX: R18.1 TP10.TP?(Test_point) U4.22(GNSS_TXD)
GNSS_ANT: E1.1(FEED) U4.15(GNSS_ANT)
GNSS_VCC_EN: TP11.TP?(Test_point) U4.28(GNSS_VCC_EN)
IO3: U5.15(IO3)
IO6: J4.1 U5.6(IO6)
IO7: J4.2 U5.7(IO7)
IO8: U5.12(IO8)
IO9: U5.17(IO9)
IO10: U5.18(IO10)
IO11: U5.19(IO11)
IO12: U5.20(IO12)
IO13: U5.21(IO13)
IO15: J5.1 U5.8(IO15)
IO16: J5.2 U5.9(IO16)
IO19: P3.2 U5.13(IO19)
IO20: P3.3 U5.14(IO20)
IO38: J2.5 U5.31(IO38)
IO39: J2.4 U5.32(IO39)
IO40: J2.3 U5.33(IO40)
IO41: J2.2 U5.34(IO41)
IO42: J2.1 U5.35(IO42)
IO45-PWRKEY: R14.1 U5.26(IO45)
IO46: U5.16(IO46)
NETLIGHT: R28.1 U4.47(NETLIGHT)
PWRKEY: R33.2 U4.5(PWRKEY)
RF_ANT: E2.1(FEED) U4.41(RF_ANT)
RXD0: U5.36(RXD0) UART.3
RXD_AUX: R18.2 U4.24(RXD_AUX)
SIM1_DATA: C32.1 R21.1 U4.21(SIM1_DATA)
SIM1_RST: C33.1 R25.2 U4.20(SIM1_RST)
SIM1_VDD: C28.2 C30.1 J3.C1(VCC) U4.18(SIM1_VDD)
SIM_CLK: C29.1 R22.2 U4.19(SIM1_CLK)
SIM_GND: C28.1 J3.C5(GND) U4.16(SIM_GND)
SIM_PRESENCE: J3.CD R19.2 U4.37(DTR)
TXD0: U5.37(TXD0) UART.2
TXD_AUX: R20.2 U4.25(TXD_AUX)
VDD_EXT: C17.1 R19.1 U4.43(VDD_EXT)
VRTC: C31.2(A) R26.2 U4.52(VRTC)
NetD4_1: D4.1(C) R23.1
NetD5_1: D5.1(C) R24.1
NetD6_1: D6.1(C) R26.1
NetJ3_C2: J3.C2(RST) R25.1
NetJ3_C3: J3.C3(CLK) R22.1
NetJ3_C7: J3.C7(I/O) R21.2
NetQ1_1: Q1.1(B) R14.2 R16.1
NetQ1_3: Q1.3(C) R33.1
NetQ2_1: Q2.1(B) R27.2 R29.1
NetQ2_3: Q2.3(C) R23.2
NetQ3_1: Q3.1(B) R28.2 R30.1
NetQ3_3: Q3.3(C) R24.2

Not connected (* = marked no-connect by the designer): J3 C6(VPP)*; U4 1(MICP)* 2(MICN)* 3(SPKP)* 4(SPKN)* 6(ADC)* 7(SD_CMD)* 8(SD_CLK)* 9(SD_DATA)* 10(SIM2_CLK)* 11(SIM2_DATA)* 12(SIM2_RST)* 13(SIM2_VDD)* 32(BT_ANT)* 35(RI)* 36(DCD)* 38(CTS)* 39(RTS)* 46(RESERVED) 53(LOUDSPKN)* 54(LOUDSPKP)* 55(RESERVED) 56(RESERVED) 57(RESERVED) 58(RESERVED) 59(PCM_CLK)* 60(PCM_OUT)* 61(PCM_SYNC)* 62(PCM_IN)* 63(RESERVED) 64(RESERVED) 65(RESERVED) 66(RESERVED) 67(RESERVED) 68(RESERVED); U5 4(IO4) 5(IO5) 24(IO47) 25(IO48) 28(IO35)* 29(IO36)* 30(IO37)* 38(IO2) 39(IO1)

### Notes on the sheet
- UART
- (in symbol CMP-05427-000047-1) +
- (in symbol CMP-05428-000959-1) +

### Library data of the parts
BOOT RESET = CMP-10040-000001-2: SWITCH TACTILE SPST-NO 0.05A 16V; Throw Configuration: SPST; Operating Force: 160gf; Actuator Type: Standard; Switch Travel: 0.15mm; Switch Function: Off-Mom; Max Current Rating: 50mA; Mechanical Life: 150000Cycles; Illumination Type: Non-Illuminated; Package Quantity: 2900; Depth: 4.6mm; Mount: Surface Mount; Packaging: Tape and Reel; Length: 3.2mm; RoHS Compliant: Yes; Case/Package: SMD/SMT; Voltage Rating (DC): 16V; Min Operating Temperature: -40°C; Termination: J-Bend; Lead Free: Lead Free; Contact Plating: Silver; Orientation: Straight; Max Operating Temperature: 85°C; Current Rating: 50mA; Color: Black
C14 C26 C27 = CMP-2100-03606-3: as C6 on sheet pwrmngmnt; Device Class L1: Passive Components; ComponentLink2Description: Datasheet; Package: CC0805-0.85; Digikey Description: CAP CER 0.1UF 50V X7R 0805; Device Class L3: Ceramic Capacitors; Temperature: -30°C to +85°C; Temperature Characteristic: X7R; Voltage Rating: 50 V; Height: 0.95mm; RoHS: TRUE; Ipc Land Pattern Name: CAPC200125X85; Device Class L2: Capacitors; Category: Cap; Temperature Range Low: -30°C; Temperature Range High: +85°C; Mouser Description: Multilayer Ceramic Capacitors MLCC - SMD/SMT 100nF 50V X7R 10%; Footprint Url: http://www.yageo.com/exep/pages/download/literatures/UPY-C_GEN_24.pdf; Automotive: No; Octopart: https://octopart.com/cc0805krx7r9bb104-yageo-192993; Lead Free: Yes; ComponentLink2URL: http://www.yageo.com/documents/recent/UPY-GPHC_Y5V_6.3V-to-50V_8.pdf
C15 C17 C34 = CMP-03020-034671-1: CAP CER 10UF 16V X5R 0805; Dissipation Factor: 5%; Tolerance: 10%; Dielectric Material: Ceramic; REACH SVHC: No SVHC; Packaging: Tape and Reel; Series: C; Min Operating Temperature: -55°C; Construction: Flat; Radiation Hardening: No; Case Code (Metric): 2012; Contact Plating: Tin; Case Code (Imperial): 0805; Voltage Rating: 16V; Mount: Surface Mount; Width: 0.049inch; Voltage: 16V; Dielectric: X5R; Height: 1.25mm; Depth: 1.25mm; Case/Package: 0805; Max Operating Temperature: 85°C; Length: 2mm; Thickness: 0.055inch; Termination: SMD/SMT; Capacitance: 10uF; Number of Pins: 2; Voltage Rating (DC): 16V; Lead Free: Lead Free; Package Quantity: 1
C16 C18 C23 = CMP-1036-04410-2: CAP CER 0.1UF 25V X7R 0805; Manufacturer Part Number: CC0805KRX7R8BB104; Manufacturer: Yageo; Tolerance: 0.1; Material: Ceramic; Value: 100 nF; ComponentLink2URL: http://www.yageo.com/documents/recent/UPY-GPHC_Y5V_6.3V-to-50V_8.pdf; Category: Cap; Mouser Description: Multilayer Ceramic Capacitors MLCC - SMD/SMT 100nF 25V X7R 10%; Device Class L1: Passive Components; Footprint Url: http://www.yageo.com/exep/pages/download/literatures/UPY-C_GEN_24.pdf; Height: 0.95mm; Digikey Description: CAP CER 0.1UF 25V X7R 0805; Lead Free: Yes; Temperature Range High: +85°C; Temperature: -30°C to +85°C; Ipc Land Pattern Name: CAPC200125X85; Capacitance: 100 nF; Automotive: No; Octopart: https://octopart.com/cc0805krx7r8bb104-yageo-39467766; Device Class L2: Capacitors; Temperature Characteristic: X7R; Voltage Rating: 25 V; ComponentLink2Description: Datasheet; Temperature Range Low: -30°C; Device Class L3: Ceramic Capacitors; RoHS: TRUE; Package: CC0805-0.85
C19 = CMP-2007-03385-2: Chip Multilayer Ceramic Capacitors for General Purpose, 0805, 22uF, X5R, 15%, 20%, 6.3V; Material: Ceramic; Max Operating Temperature: 85°C; Voltage: 6.3V; Min Operating Temperature: -55°C; Case/Package: 0805; Thickness: 0.053inch; Dielectric: X5R; Packaging: Tape and Reel; Depth: 1.25mm; Termination: SMD/SMT; Voltage Rating (DC): 6.3V; Radiation Hardening: No; Tolerance: 20%; Mount: Surface Mount; Lead Free: Lead Free; Package Quantity: 1; REACH SVHC: No SVHC; Voltage Rating: 6.3V; Capacitance: 22uF; Length: 2mm; Case Code (Imperial): 0805; Case Code (Metric): 2012; Width: 0.049inch; Height: 1.25mm
C20-C22 = CMP-05427-000047-1: CAP ALUM 100UF 20% 10V SMD; Life (Hours): 1000Hour; Ripple Current: 50mA; Packaging: Tape and Reel; Diameter: 5mm; Voltage Rating (DC): 10V; Mount: Surface Mount; Max Operating Temperature: 85°C; Length: 5.5mm; Case/Package: Radial; Height: 5.4mm; Construction: Cylindrical; Termination: SMD/SMT; Height - Seated (Max): 0.213inch; Series: S; Min Operating Temperature: -40°C; Capacitance: 100uF; Tolerance: 20%; Voltage Rating: 10V; Package Quantity: 1; Radiation Hardening: No; Ripple Current (AC): 50mA; Lead Free: Lead Free; RoHS Compliant: Yes; Contact Plating: Tin
C24 = CMP-1036-00875-3: Cap Ceramic 10pF 100V C0G 5% SMD 0805 125C Plastic T/R; Manufacturer Part Number: C0805C100J1GACTU; Manufacturer: KEMET; Temperature Coefficient: 30ppm/°C; Tolerance: 0.05; Capacitance: 10 pF; Category: Cap; Height: 0.88mm; Temperature: -55°C to +125°C; Device Class L2: Capacitors; Temperature Characteristic: C0G; Lead Free: Yes; RoHS: TRUE; Octopart: https://octopart.com/c0805c100j1gactu-kemet-127179; Temperature Range Low: -55°C; Device Class L3: Ceramic Capacitors; Device Class L1: Passive Components; Temperature Range High: +125°C; Material: Ceramic; Package: C0805C-DN; Mouser Description: Multilayer Ceramic Capacitors MLCC - SMD/SMT 100volts 10pF C0G 5%; Ipc Land Pattern Name: CAPC200125X78; Voltage Rating: 100 V; Value: 10 pF; ComponentLink2URL: https://content.kemet.com/datasheets/KEM_C1003_C0G_SMD.pdf; Automotive: No; ComponentLink2Description: Datasheet; Digikey Description: Cap Ceramic 10pF 100V C0G 5% SMD 0805 125C Plastic T/R
C25 = CMP-2006-03168-3: Capacitor; Ceramic; Cap; 33.0pF; Tol 5%; SMT; Vol-Rtg 50V; C0G; Tape and Reel; Manufacturer Part Number: C0603C330J5GACTU; Manufacturer: KEMET; Tolerance: 0.05; Temperature Coefficient: 30ppm/°C; Automotive Grade: Grade 1; Height: 0.87mm; Digikey Description: Capacitor; Ceramic; Cap; 33.0pF; Tol 5%; SMT; Vol-Rtg 50V; C0G; Tape and Reel; Value: 33 pF; Material: Ceramic; RoHS: TRUE; Device Class L1: Passive Components; Temperature Characteristic: C0G; Capacitance: 33 pF; Voltage Rating: 50 V; Automotive: Yes; Temperature Range High: +125°C; ComponentLink2Description: Datasheet; ComponentLink2URL: https://api.kemet.com/component-edge/download/datasheet/C0603C100J5GACAUTO.pdf; Category: Cap; Mouser Description: Capacitor; Ceramic; Cap; 33.0pF; Tol 5%; SMT; Vol-Rtg 50V; C0G; Tape and Reel; Temperature Range Low: -55°C; Octopart: https://octopart.com/c0603c330j5gactu-kemet-87666; Temperature: -55°C to +125°C; Lead Free: Yes; Device Class L3: Ceramic Capacitors; Package: C0603C-CF; Device Class L2: Capacitors
C28 = CMP-13271-002648-1: CL21 Series 0805 150nF 16V ±10% Tolerance X7R Multilayer Ceramic Chip Capacitor; Max Operating Temperature: 125°C; Depth: 1.25mm; Height: 0.65mm; Tolerance: 10%; Case/Package: 0805; Width: 0.049inch; Packaging: Tape and Reel; Case Code (Metric): 2012; Thickness: 0.03inch; Min Operating Temperature: -55°C; Radiation Hardening: No; Mount: Surface Mount; Case Code (Imperial): 0805; Voltage Rating (DC): 16V; Dielectric: X7R; Capacitance: 150nF; Length: 2mm; Voltage Rating: 16V; Package Quantity: 1
C29 C30 C32 C33 = CMP-04427-014896-1: General Purpose Ceramic Capacitor, 0603, 33pF, 5%, NP0, 30ppm/°C, 50V; Dielectric: C0G; Insulation Resistance: 100GR; Max Operating Temperature: 125°C; REACH SVHC: No SVHC; Min Operating Temperature: -55°C; Tolerance: 5%; RoHS Compliant: Yes; Voltage Rating (DC): 50V; Case Code (Imperial): 0603; Termination: SMD/SMT; Lead Free: Lead Free; Thickness: 0.034inch; Dielectric Material: Ceramic; Mount: Surface Mount; Voltage: 50V; Packaging: Tape and Reel; Temperature Coefficient: 30ppm/°C; Height: 0.63mm; Depth: 0.81mm; Case Code (Metric): 1608; Width: 0.81mm; Length: 1.6mm; Radiation Hardening: No; Package Quantity: 4000; Contact Plating: Tin; Capacitance: 33pF; Voltage Rating: 50V; Number of Pins: 2; Case/Package: 0603
C31 = CMP-05428-000959-1: Conductive Polymer Aluminum Solid Capacitors (OS-CON) 47uF ±20% 10V; Life (Hours): 2000Hour; Ripple Current (AC): 1.62A; Leakage Current: 94uA; Polarity: Polar; ESR (Equivalent Series Resistance): 50mR; Dissipation Factor: 12%; Length: 5.9mm; Tolerance: 20%; Min Operating Temperature: -55°C; Voltage Rating: 10V; Mount: Surface Mount; Capacitance: 47uF; Series: OS-CON™, SVP; Case/Package: Radial; Package Quantity: 1000; Voltage Rating (DC): 10V; Voltage: 10V; Max Operating Temperature: 105°C; Diameter: 6.3mm; Material: Polymer; Packaging: Tape and Reel; Termination: SMD/SMT; Number of Pins: 6; Height: 5.9mm; Lead Free: Lead Free; Height - Seated (Max): 0.236inch; RoHS Compliant: Yes; Construction: Cylindrical; REACH SVHC: No SVHC; Ripple Current: 1.62A
D4 D5 = CMP-02129-71131536-1: HSMR-C191 High-Performance Chip LED Single Color LED, Blue, Untinted Diffused, 1mm; Power Dissipation: 78mW; Luminous Flux: 88lm; Number of Elements: 1; Test Current: 20mA; Forward Voltage: 3.4V; Wavelength: 473nm; Lens Color: Clear, White; Reverse Voltage: 5V; Viewing Angle: 140°; Luminous Intensity: 55mcd; Max Junction Temperature (Tj): 95°C; Peak Wavelength: 469nm; Case/Package: 0603; Mount: Surface Mount; Schedule B: 8541402000; Number of LEDs: 1; Min Operating Temperature: -40°C; Power Rating: 78mW; Case Code (Metric): 1608; Length: 1.6mm; Radiation Hardening: No; Dominant Wavelength: 473nm; Color: Blue; Width: 800µm; Lead Free: Lead Free; Illumination Color: Blue; Depth: 800µm; Height: 600µm; NexarPartId: 71131536; Case Code (Imperial): 0603; Number of Pins: 2; RoHS: Compliant; Max Operating Temperature: 85°C; Lens Transparency: Diffused; Packaging: Tape and Reel; Max Power Dissipation: 78mW; Lens Style: Diffused; Contact Plating: Gold; REACH SVHC: No SVHC; Forward Current: 20mA
D6 = CMP-0303-00003-3: DIODE SCHOTTKY 40V 1A SOD123; Forward Voltage: 450mV; Capacitance: 110pF; Max Forward Surge Current (Ifsm): 25A; Peak Reverse Current: 50uA; Polarity: Standard; Element Configuration: Single; Max Power Dissipation: 450mW; Min Operating Temperature: -65°C; Package Quantity: 3000; Contact Plating: Tin; Weight: 0.000353oz; Max Repetitive Reverse Voltage (Vrrm): 40V; Max Reverse Voltage (DC): 40V; Height: 1.25mm; Average Rectified Current: 1A; Width: 1.7mm; Case/Package: SOD-123-2; Lead Free: Lead Free; Max Operating Temperature: 125°C; Current Rating: 1A; Termination: SMD/SMT; Forward Current: 1A; Radiation Hardening: No; Number of Pins: 2; Length: 2.85mm; Voltage Rating (DC): 40V; REACH SVHC: No SVHC; Peak Non-Repetitive Surge Current: 25A; Packaging: Tape and Reel; Output Current: 1A
E2 = NN02-224: Ultra-compact form antenna booster for GSM, UMTS, 4G, GNSS, Bluetooth, Wi-Fi Dual Band (824 - 960MHz, 1710 - 2690MHz, 1561 - 1606MHz, 2400 - 2500MHz and 4900 - 5875MHz), signal booster; MF: Ignion; SnapEDA_Link: https://www.snapeda.com/parts/NN02-224/Ignion/view-part/?ref=snap; Package: SMD Ignion; Value: *; MP: NN02-224; Check_prices: https://www.snapeda.com/parts/NN02-224/Ignion/view-part/?ref=eda
J2 = CMP-00257-00278173-1: 22-28-4050 KK® 254 Breakaway Header, Vertical, 5 Circuits, Tin (Sn) Plating, Mating Pin Length 6.09mm; NexarPartId: 278173; Voltage Rating: 250V; Number of Contacts: 5; Contact Resistance: 20mΩ; Gender: Male; Pitch: 2.54mm; Connector Type: Male Pin; Current Rating: 4A; Glow Wire Compliant: Non-compliant; Max Voltage Rating (DC): 250.25kV; Flammability Rating: UL94 V-0; Min Operating Temperature: 0°C; REACH SVHC: Unknown; Lead Free: Lead Free; Termination: Solder; RoHS: Compliant; Schedule B: 8536694040; Number of Circuits: 5; Mount: Through Hole; Lead Pitch: 2.54mm; Height: 2.29mm; Voltage Rating (DC): 250V; Max Operating Temperature: 75°C; Width: 2.49mm; Radiation Hardening: No; Contact Plating: Tin; Orientation: Vertical; Length: 12.7mm; Number of Rows: 1; Housing Material: Thermoplastic; Contact Material: Brass; Packaging: Bulk; Contact Mating Length: 6.096mm; Housing Color: Black; Color: Black; Number of Positions: 5
J3 = SIM7100-6-1-15-00-A_REVC2: 7 (6 + 1) Position Card Connector Micro SIM Surface Mount, Right Angle Gold; MF: Global Connector Technology; SnapEDA_Link: https://www.snapeda.com/parts/SIM7100-6-1-15-00-A/Global+Connector+Technology/view-part/?ref=snap; Package: None; Value: *; MP: SIM7100-6-1-15-00-A; Check_prices: https://www.snapeda.com/parts/SIM7100-6-1-15-00-A/Global+Connector+Technology/view-part/?ref=eda
J4 J5 = CMP-15831-000005-1: CONN HEADER VERT 2POS 2MM; Manufacturer: Harwin; Conn Gender: Male; Current Rating: 2A; Number Of Contacts: 2; Conn Orientation: Vertical; Temperature Range Low: -40°C; Device Class L1: Connectors; ComponentLink2URL: https://cdn.harwin.com/pdfs/C018XX_M22_Series_Connectors.pdf; Temperature Range High: +105°C; Pitch: 2mm; Number Of Rows: 1; Temperature: -40°C to +105°C; Automotive: No; Device Class L3: unset; Octopart: https://octopart.com/m22-2510205-harwin-2538221; Mouser Description: Headers & Wire Housings 2 PIN SIL VERTICAL GOLD PIN HEADER; Height: 5.45mm; Category: Conn; Digikey Description: CONN HEADER VERT 2POS 2MM; Contact Material: Gold,Nickel; Lead Free: Yes; ComponentLink2Description: Datasheet; Manufacturer Part Number: M22-2510205; Device Class L2: Headers and Wire Housings; Package: 0; Footprint Url: https://cdn.harwin.com/pdfs/M22-251.pdf; RoHS: TRUE
P3 UART = CMP-1024-00358-1: 0.025" SQ Post Header, Through-hole, Vertical, -55 to 125 degC, 2.54 mm Pitch, 4-Pin, Male, RoHS; Manufacturer: Samtec; Pitch: 2.54 mm; PartNumber: TSW-104-08-L-S; RoHS: True; Temperature Range: -55 to 125 degC; PackageDescription: .025[0.64] SQ. Post Terminal Strip Assembly; Orientation: Vertical; ComponentLink2URL: http://www.samtec.com/documents/webfiles/pdf/TSW_TH.PDF; ComponentLink1Description: Manufacturer URL; ComponentLink2Description: Datasheet; PackageVersion: DM, 8/1988; ComponentLink3URL: http://www.samtec.com/documents/webfiles/cpdf/TSW-XXX-XX-XXX-X-XX-XXX-MKT.pdf; Mounting Technology: Through-hole; PackageReference: TSW-104-08-X-S; ComponentLink3Description: Package Specification; ComponentLink1URL: http://www.samtec.com; DatasheetVersion: F-214
Q1-Q3 = CMP-1048-00558-1: Low Noise Transistor, NPN Silicon, 3-Pin SOT-23, Pb-Free, Tape and Reel; Manufacturer: On Semiconductor; IC Continuous (A): 0.05; fT Min (MHz): 50; PartNumber: MMBT5088LT1G; PackageDescription: 3-Pin Small Outline Transistor, Body 2.92 x 1.3 mm, Pitch 0.95 mm; RoHS: TRUE; ComponentLink2URL: http://www.onsemi.cn/pub_link/Collateral/MMBT5088LT1-D.PDF; PackageVersion: Rev. AP, 11/2009; Mounting Technology: Surface Mount; Packing: Tape and Reel; ComponentLink1URL: http://www.onsemi.com/; PackageReference: SOT-23-3-318-08; ComponentLink2Description: Datasheet; ComponentLink1Description: Manufacturer URL; DatasheetVersion: Rev. 4; Polarity: NPN; ComponentLink3Description: Package Specification; ComponentLink3URL: http://www.onsemi.cn/pub_link/Collateral/318-08.PDF
R14 R27 R28 = CMP-2000-05024-1: Chip Resistor, 4.7 KOhm, +/- 5%, 100 mW, -55 to 155 degC, 0603 (1608 Metric), RoHS, Tape and Reel; Manufacturer: Yageo; Resistance: 4.7kOhms; Temperature Coefficient: 100PPM/C; Power Rating: 100mW; Voltage Rating: 50V; Operating Temperature Range: -55Cto+155C; Case Code - mm: 1608; Tolerance: 5%; Product: ThickFilmResistorsGeneralPurpose; Case Code - in: 0603; Datasheet URL: http://www.yageo.com/documents/recent/PYu-RC_Group_51_RoHS_L_04.pdf; Package Reference: 603; Datasheet Version: Rev. 4, 02/2016; Package Description: 2-Pin Surface Mount Device, Body 1.6 x 0.8 mm; Manufacturer URL: http://www.yageo.com/; Series: RC; Packaging: Reel; Termination Style: SMD/SMT
R15 = CMP-03412-034151-1: RES SMD 10K OHM 0.1% 1/8W 0805; Manufacturer: Yageo; Manufacturer Part Number: RT0805BRD0710KL; Voltage Rating: 150V; Tolerance: 0.0025; Resistance: 10KΩ; Temperature Coefficient: 25 ppm/°C; Power Rating: 0.125W; Value: 10KΩ; Composition: Thin Film; Device Class L3: Chip SMD Resistors; Octopart: https://octopart.com/rt0805brd0710kl-yageo-1290190; Ipc Land Pattern Name: RESC200125X50; Series: RT; Device Class L1: Passive Components; Lead Free: Yes; Device Class L2: Resistors; RoHS: TRUE; Height: 0.6mm; Temperature Range Low: -55°C; Category: Res; Mouser Description: Thin Film Resistors - SMD 10K OHM .1% 25PPM; Temperature: -55°C to +155°C; Package: RT0805; Footprint Url: http://www.yageo.com/exep/pages/download/literatures/PYu-R_Mount_10.pdf; Automotive: No; Digikey Description: RES SMD 10K OHM 0.1% 1/8W 0805; Temperature Range High: +155°C; ComponentLink2Description: Datasheet; ComponentLink2URL: http://www.yageo.com/documents/recent/PYu-RT_1-to-0.01_RoHS_L_9.pdf
R16 R29 R30 = CMP-1659-00055-2: RES SMD 47K OHM 1% 1/10W 0603; Voltage Rating: 50V; Temperature Coefficient: 100ppm/°C; Max Power Dissipation: 100mW; Resistance: 47kR; Voltage Rating (DC): 50V; Min Operating Temperature: -55°C; Packaging: Tape and Reel; Features: Moisture Resistant; Termination: SMD/SMT; Technology: THICK FILM; Lead Free: Lead Free; Max Operating Temperature: 155°C; Width: 0.031inch; Case Code (Metric): 1608; Tolerance: 1%; Package Quantity: 1; Resistor Type: Thick Film; RoHS Compliant: Yes; Case/Package: 0603; Case Code (Imperial): 0603; Resistance Tolerance: 1%; Length: 0.063inch; Series: RC; Number of Pins: 2; Power Rating: 100mW; Number of Terminations: 2; Construction: Rectangular; Height: 0.022inch; Military Standard: Not; Size Code: 0603; Depth: 0.8mm
R18 R20 = CMP-26527-000017-1: as R7 on sheet pwrmngmnt; Depth: 1.25mm; Length: 2mm; Military Standard: Not; Width: 0.049inch; Case Code (Imperial): 0805; Number of Terminations: 2; Mount: Surface Mount; Contact Plating: Tin; Height: 0.026inch; Case/Package: 0805; Min Operating Temperature: -55°C; Composition: Thick Film; Max Operating Temperature: 155°C; Packaging: Tape and Reel; Features: Automotive AEC-Q200; Max Power Dissipation: 125mW; Radiation Hardening: No; Lead Free: Lead Free; Case Code (Metric): 2012
R19 = CMP-03412-005349-1: as R2 on sheet pwrmngmnt; RoHS: TRUE; Category: Res; Automotive: No; Digikey Description: RES SMD 10K OHM 1% 1/10W 0603; ComponentLink2Description: Datasheet; Octopart: https://octopart.com/rt0603fre0710kl-yageo-40009243; ComponentLink2URL: http://www.yageo.com/documents/recent/PYu-RT_1-to-0.01_RoHS_L_9.pdf; Device Class L3: Chip SMD Resistors; Device Class L1: Passive Components; Temperature Range High: +155°C; Height: 0.55mm; Composition: Thin Film; Ipc Land Pattern Name: RESC16080X45; Series: RT; Package: RT0603; Resistance: 10KΩ; Footprint Url: http://www.yageo.com/exep/pages/download/literatures/PYu-R_Mount_10.pdf; Temperature: -55°C to +155°C; Temperature Range Low: -55°C; Lead Free: Yes; Device Class L2: Resistors; Mouser Description: Thin Film Resistors - SMD 10K ohm 1% 1/10W
R21 R22 R25 = CMP-2002-01135-4: Chip Resistor, 22 Ohm, +/- 1%, 0.1 W, -55 to 155 degC, 0402 (1005 Metric), RoHS, Tape and Reel; PartNumber: ERJ-2RKF22R0X; Case\/Package: 0402; Resistance: 22 Ohm; Power Rating: 100 mW; Voltage Rating: 50 V; ComponentLink2Description: Datasheet; Packaging: Tape and Reel; Weight: 2.8E-05oz; Pins: 2; Case Code (Imperial): 0402; Width: 0.5 mm; ComponentLink2URL: http://industrial.panasonic.com/cdbs/www-data/pdf/RDA0000/AOA0000C86.pdf; Height: 0.35 mm; PackageReference: 0402; REACH SVHC: Yes; Min Operating Temperature: -55 degC; Length: 1 mm; DatasheetVersion: 04/2015; RoHSCompliant: true; Package Quantity: 10000; Case Code (Metric): 1005; PackageDescription: 2-Pin Surface Mount Device, Body 1 x 0.5 mm; ComponentLink1URL: http://www.panasonic.com/; Mount: Surface Mount; Mounting Technology: Surface Mount; Tolerance: 1%; Max Operating Temperature: 155 degC; ComponentLink1Description: Manufacturer URL
R23 R24 R33 = CMP-2000-03216-2: RES Thick Film, 300Ω, 1%, 0.1W, 100ppm/°C, 0603; Voltage Rating (DC): 75V; Power Rating: 100mW; Resistance: 300R; Length: 1.55mm; Height: 0.45mm; Case/Package: 0603; Temperature Coefficient: 100ppm/°C; Packaging: Tape and Reel; Termination: SMD/SMT; Depth: 0.85mm; Max Operating Temperature: 155°C; Radiation Hardening: No; Tolerance: 1%; Lead Free: Lead Free; Case Code (Metric): 1608; Voltage Rating: 75V; Weight: 7.1E-05oz; Package Quantity: 10; Military Standard: Not; Case Code (Imperial): 0603; Composition: Thick Film; Min Operating Temperature: -55°C; Width: 0.033inch; Number of Terminations: 2; Mount: Surface Mount; Features: Automotive AEC-Q200; Contact Plating: Tin; Max Power Dissipation: 100mW
R26 = CMP-2003-02206-1: Manufacturer: Vishay Dale; Part Number: CRCW1206470RFKEA
TP5-TP11 = Test_Point: Value: Test point
U4 = MC60: Quad-band GSM/GPRS/GNSS module; 18.7mm 16.0mm 2.1mm; Max. data rate: 85.6Kbps; SMT form factor; LCC castellation packaging; Extended temperature range of -40C to +85C.; MF: Quectel; SnapEDA_Link: https://www.snapeda.com/parts/MC60/Quectel/view-part/?ref=snap; Package: Custom Quectel; Value: *; MP: MC60; Check_prices: https://www.snapeda.com/parts/MC60/Quectel/view-part/?ref=eda
U5 = ESP32-S3-WROOM-1-N8R8: Bluetooth, WiFi 802.11b/g/n, Bluetooth v5.0 Transceiver Module 2.4GHz PCB Trace Surface Mount; MF: Espressif Systems; Package: None; Price: None; Check_prices: https://www.snapeda.com/parts/ESP32-S3-WROOM-1-N8R8/Espressif+Systems/view-part/?ref=eda; Value: *; SnapEDA_Link: https://www.snapeda.com/parts/ESP32-S3-WROOM-1-N8R8/Espressif+Systems/view-part/?ref=snap; MP: ESP32-S3-WROOM-1-N8R8; Availability: In Stock; Purchase-URL: https://pricing.snapeda.com/search?q=ESP32-S3-WROOM-1-N8R8&ref=eda
E1 = YFGC025WWB: Package: None; Price: None; Value: *; MP: YFGC025WWB; Availability: Unavailable

## Nets that join several sheets
GND: pwrmngmnt (21 pins), esp32v4 (48 pins)
VBAT: pwrmngmnt (5 pins), esp32v4 (10 pins)
3V3: pwrmngmnt (6 pins), esp32v4 (14 pins)

## Assembly variants
esp32_v4_variant: not fitted C4 C8 C10 C34